# Altium schematic sheet daughter.SchDoc
size 431 x 279 mm; SheetNumber: 2; SheetTotal: 2
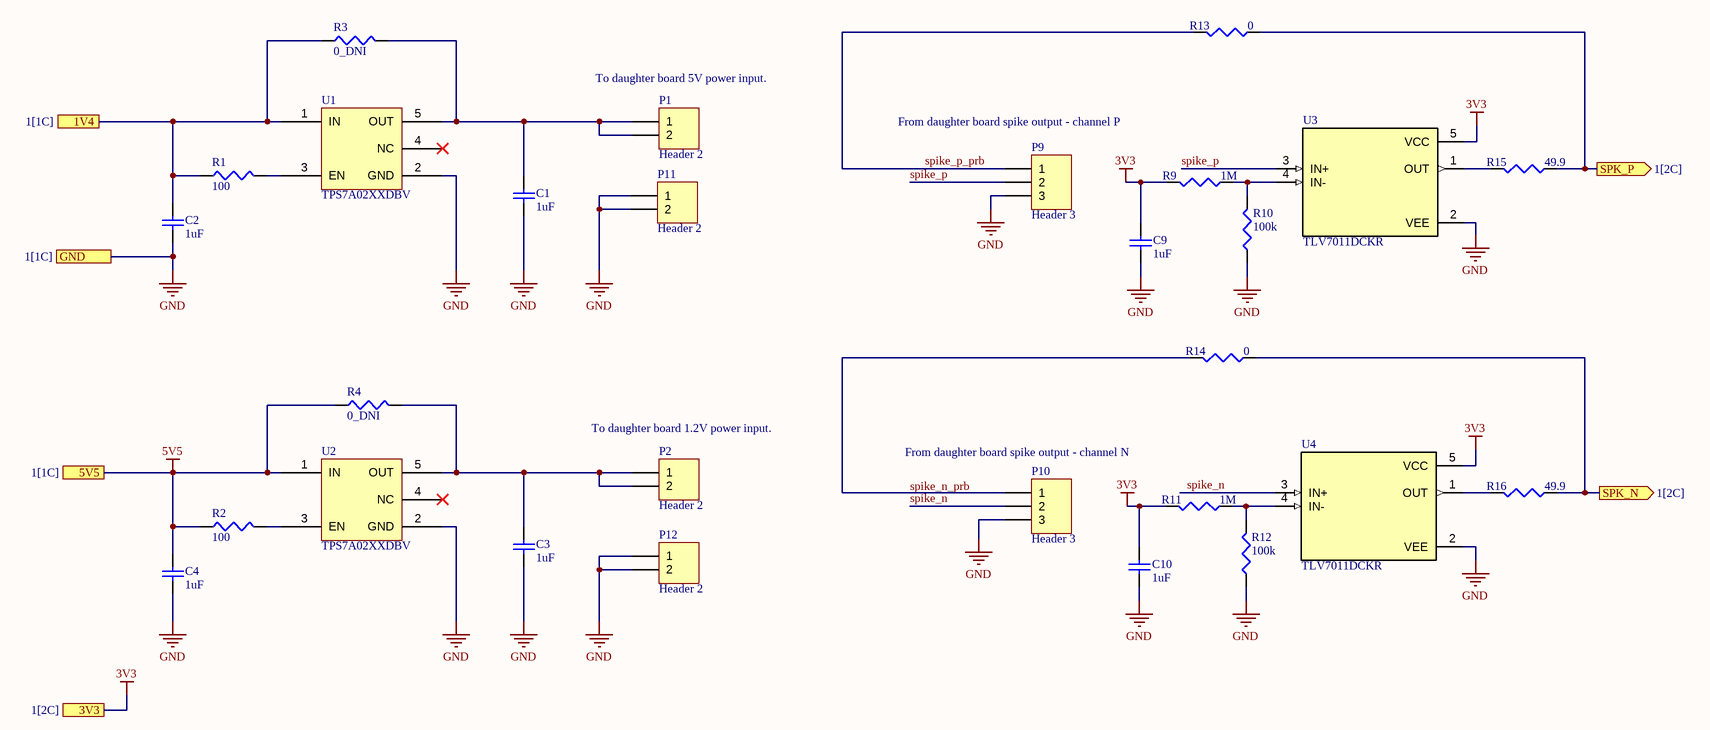
[diagram p0: daughter.SchDoc]

## Parts
C1  1uF  [SMD-0603]
C2  1uF  [SMD-0603]
C3  1uF  [SMD-0603]
C4  1uF  [SMD-0603]
C9  1uF  [SMD-0603]
C10  1uF  [SMD-0603]
P1  Header 2  [HDR1X2]
P2  Header 2  [HDR1X2]
P9  Header 3  [HDR1X3]
P10  Header 3  [HDR1X3]
P11  Header 2  [HDR1X2]
P12  Header 2  [HDR1X2]
R1  100  [SMD-0603]
R2  100  [SMD-0603]
R3  0_DNI  [SMD-0603]
R4  0_DNI  [SMD-0603]
R9  1M  [SMD-0603]
R10  100k  [SMD-0603]
R11  1M  [SMD-0603]
R12  100k  [SMD-0603]
R13  0  [SMD-0603]
R14  0  [SMD-0603]
R15  49.9  [SMD-0603]
R16  49.9  [SMD-0603]
U1  TPS7A02XXDBV  [SOT95P280X145-5N]
U2  TPS7A02XXDBV  [SOT95P280X145-5N]
U3  TLV7011DCKR  [SOT65P210X110-5N]
U4  TLV7011DCKR  [SOT65P210X110-5N]

## Ports
1V4 (see 1[1C]), 3V3 (see 1[2C]), 5V5 (see 1[1C]), GND (see 1[1C]), SPK_N (out, see 1[2C]), SPK_P (out, see 1[2C])

## Nets
3V3: C9.2 C10.2 R9.2 R11.2 U3.5(VCC) U4.5(VCC) ; port 3V3
5V5: C4.2 R2.1 R4.1 U2.1(IN) ; port 5V5
GND: C1.1 C2.1 C3.1 C4.1 C9.1 C10.1 P9.3 P10.3 P11.1 P11.2 P12.1 P12.2 R10.1 R12.1 U1.2(GND) U2.2(GND) U3.2(VEE) U4.2(VEE) ; port GND
1V4: C2.2 R1.1 R3.1 U1.1(IN) ; port 1V4
spike_n: P10.2 U4.3(IN+)
spike_p: P9.2 U3.3(IN+)
spike_p_prb: P9.1 R13.2
SPK_N: R14.1 R16.1 ; port SPK_N
SPK_P: R13.1 R15.1 ; port SPK_P
NetC1_2: C1.2 P1.1 P1.2 R3.2 U1.5(OUT)
NetC3_2: C3.2 P2.1 P2.2 R4.2 U2.5(OUT)
NetP10_1: P10.1 R14.2
NetR1_2: R1.2 U1.3(EN)
NetR2_2: R2.2 U2.3(EN)
NetR9_1: R9.1 R10.2 U3.4(IN-)
NetR11_1: R11.1 R12.2 U4.4(IN-)
NetR15_2: R15.2 U3.1(OUT)
NetR16_2: R16.2 U4.1(OUT)

Not connected (* = marked no-connect by the designer): U1 4(NC)*; U2 4(NC)*

## Notes on the sheet
- (near P1) To daughter board 5V power input.
- From daughter board spike output - channel P
- (near P2) To daughter board 1.2V power input.
- From daughter board spike output - channel N
- Labels drawn without touching a wire or pin: spike_n_prb
- DWG. NO.
- REV.
- SHT.
- THIS DOCUMENT AND THE DATA DISCLOSED HEREIN OR HEREWITH IS THE PROPERTY OF ALTIUM LIMITED AND MAY BE FREELY DISTRIBUTED IN WHOLE. NO RIGHTS ARE RESERVED OR EXPRESS OR IMPLIED WARANTEE GIVEN.
- REVISION
- DESCRIPTION
- DATE
- APPROVED
- ENG:
- APPROVALS
- PROJECT
- DSN:
- CHK:
- REFERENCE DOCUMENTS
- PROJECT REVISION:
- TITLE
- DOCUMENT REVISION:
- DESIGN ITEM:
- BOM:
- FAB DWG:
- PCB DWG:
- ASSY DWG:
- SCALE:
- SIZE
- B
- CAGE CODE
- FILE NAME
- DWG NO.
- SHEET
- OF
- REV

## Library data of the parts
C1-C4 C9 C10 = CAP0603: Ceramic Capacitor 0603
P1 P2 P11 P12 = Header 2: Header, 2-Pin; LatestRevisionDate: 17-Jul-2002; LatestRevisionNote: Re-released for DXP Platform.; Publisher: Altium Limited
P9 P10 = Header 3: Header, 3-Pin; LatestRevisionDate: 17-Jul-2002; LatestRevisionNote: Re-released for DXP Platform.; Publisher: Altium Limited
R1-R4 R9-R16 = RES0603: Resistor-0603
U1 U2 = TPS7A02XXDBV: TPS7A02 Nanopower IQ, 25-nA, 200-mA, Low-Dropout Voltage Regulator With Fast / Transient Response
U3 U4 = TLV7011DCKR: Low power, small size comparator with push-pull output; MF: Texas Instruments; Package: SOT-SC70-5 Texas Instruments; Availability: In Stock; Purchase-URL: https://pricing.snapeda.com/search/part/TLV7011DCKR/?ref=eda; MP: TLV7011DCKR; Value: *; SnapEDA_Link: https://www.snapeda.com/parts/TLV7011DCKR/Texas+Instruments/view-part/?ref=snap; Price: None; Check_prices: https://www.snapeda.com/parts/TLV7011DCKR/Texas+Instruments/view-part/?ref=eda